# EAGLE design bs_prod (EAGLE 6.5.0)
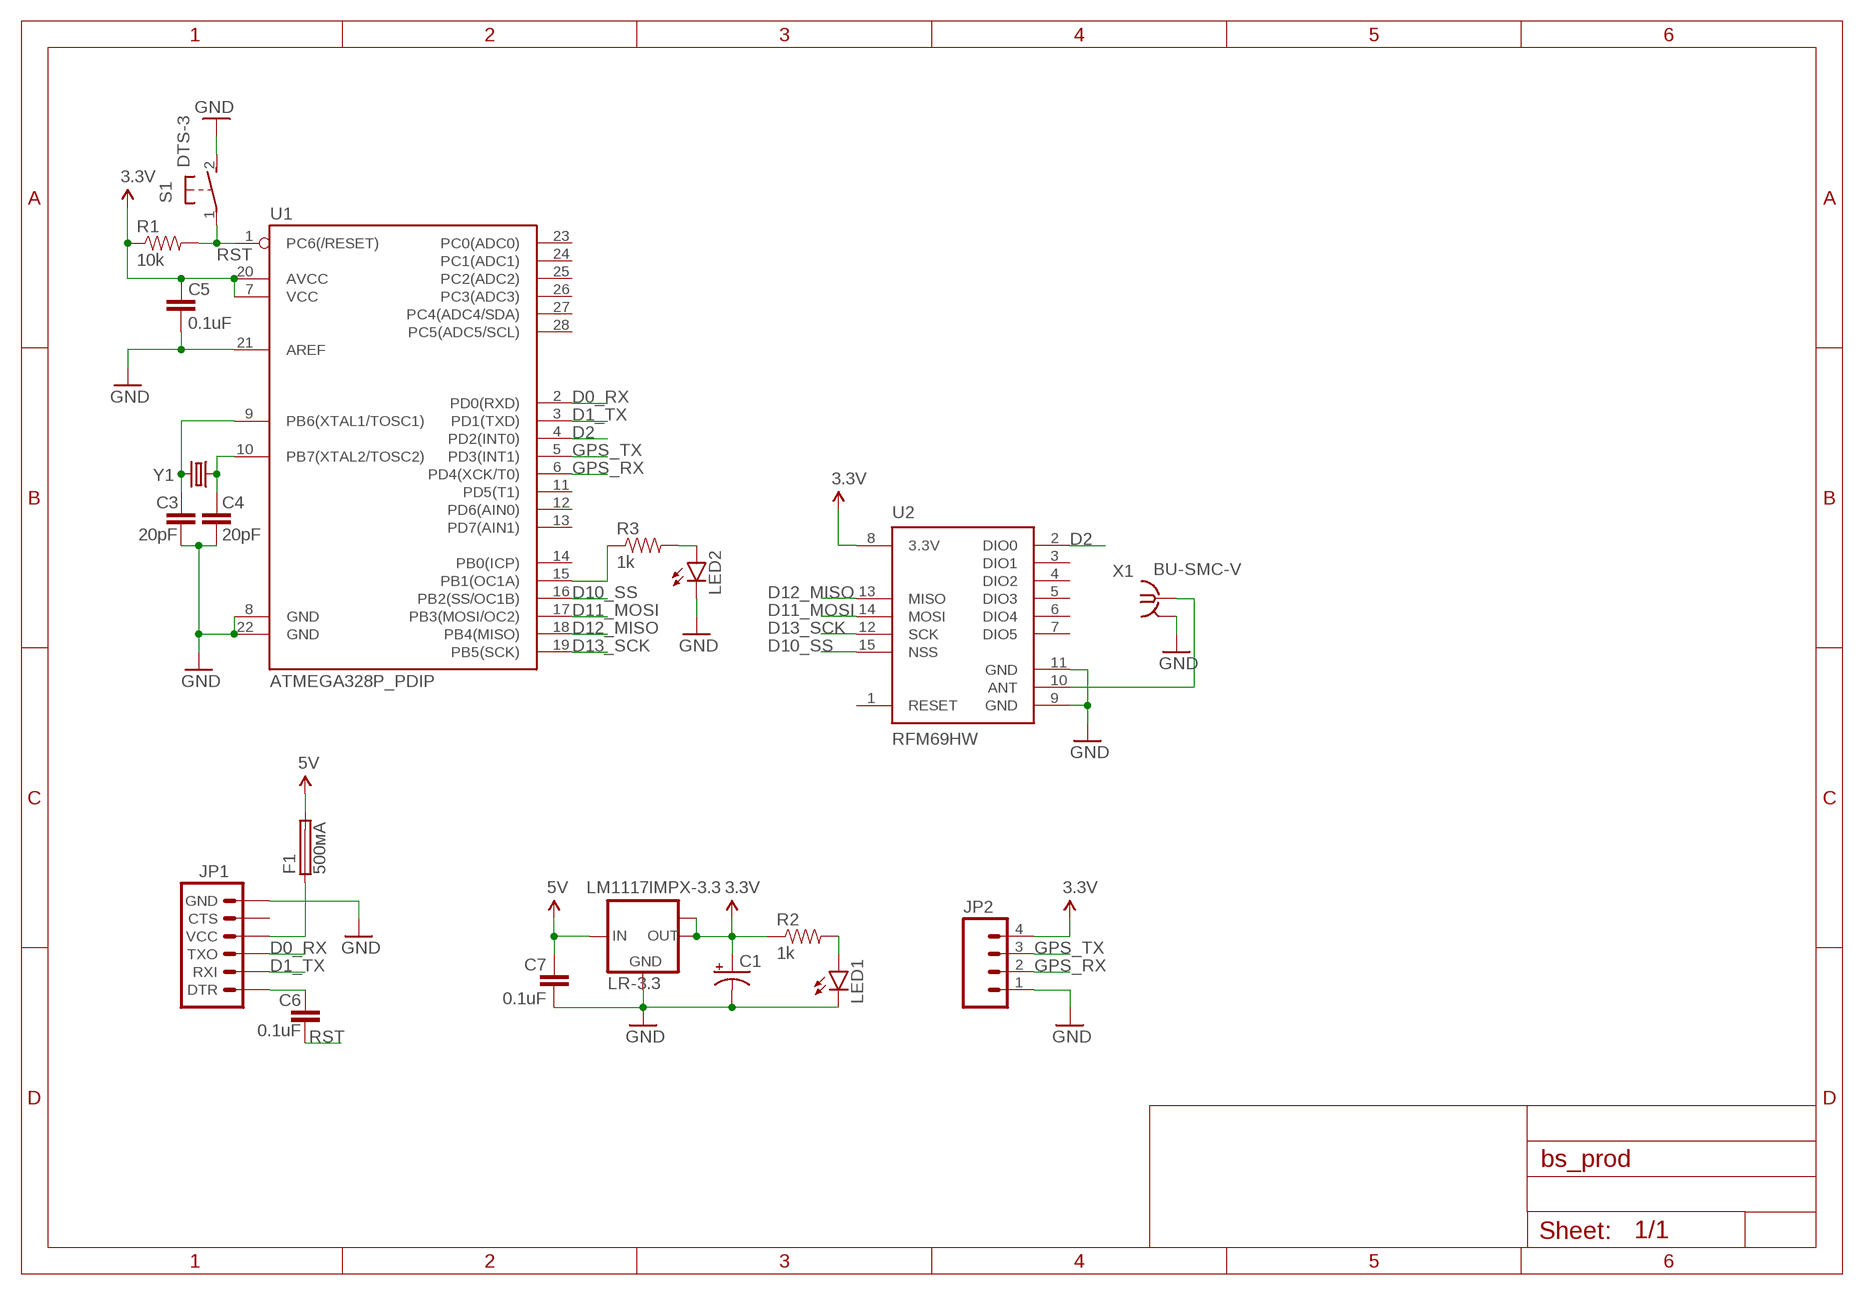
[diagram p0: schematic, sheet 1]

## Parts
C1  47UF-50V-20%(ELECT)  [PANASONIC_D]
C3  20pF  CAP1206  [1206]
C4  20pF  CAP1206  [1206]
C5  0.1uF  CAP1206  [1206]
C6  0.1uF  CAP1206  [1206]
C7  0.1uF  CAP1206  [1206]
F1  500мА  TE5  [TE5]
JP1  ARDUINO_SERIAL_PROGRAMPTH  [1X06]
JP2  M04PTH  [1X04]
LED1  LED1206  [LED-1206]
LED2  LED1206  [LED-1206]
LR-3.3  LM1117IMPX-3.3  [SOT223]
R1  10k  RESISTOR1206  [1206]
R2  1k  RESISTOR1206  [1206]
R3  1k  RESISTOR1206  [1206]
S1  DTS-3  [DTS-3]
U1  ATMEGA328P_PDIP  [DIL28-3]
U2  RFM69HW  [RFM69W-XXXS2]
X1  BU-SMC-V  [BU-SMC-V]
Y1  CRYSTALSMD  [HC49UP]

## Nets
3.3V: C1.+ C5.1 JP2.4 LR-3.3.2(OUT) LR-3.3.TAB(OUT1) R1.1 R2.1 U1.7(VCC) U1.20(AVCC) U2.8(3.3V)
5V: C7.1 F1.2 LR-3.3.3(IN)
D0_RX: JP1.3(TXO) U1.2(PD0(RXD))
D1_TX: JP1.2(RXI) U1.3(PD1(TXD))
D2: U1.4(PD2(INT0)) U2.2(DIO0)
D10_SS: U1.16(PB2(SS/OC1B)) U2.15(NSS)
D11_MOSI: U1.17(PB3(MOSI/OC2)) U2.14(MOSI)
D12_MISO: U1.18(PB4(MISO)) U2.13(MISO)
D13_SCK: U1.19(PB5(SCK)) U2.12(SCK)
GND: C1.- C3.2 C4.2 C5.2 C7.2 JP1.6(GND) JP2.1 LED1.C LED2.C LR-3.3.1(GND) S1.2 U1.8(GND) U1.21(AREF) U1.22(GND) U2.9(GND) U2.11(GND) X1.2 X1.3 X1.4 X1.5
GPS_RX: JP2.2 U1.6(PD4(XCK/T0))
GPS_TX: JP2.3 U1.5(PD3(INT1))
N$5: LED1.A R2.2
N$6: C3.1 U1.9(PB6(XTAL1/TOSC1)) Y1.2
N$7: C4.1 U1.10(PB7(XTAL2/TOSC2)) Y1.1
N$8: U2.10(ANT) X1.1
N$9: F1.1 JP1.4(VCC)
N$11: C6.1 JP1.1(DTR)
N$12: R3.1 U1.15(PB1(OC1A))
N$13: LED2.A R3.2
RST: C6.2 R1.2 S1.1 U1.1(PC6(/RESET))
Unconnected: JP1.5(CTS) U1.11(PD5(T1)) U1.12(PD6(AIN0)) U1.13(PD7(AIN1)) U1.14(PB0(ICP)) U1.23(PC0(ADC0)) U1.24(PC1(ADC1)) U1.25(PC2(ADC2)) U1.26(PC3(ADC3)) U1.27(PC4(ADC4/SDA)) U1.28(PC5(ADC5/SCL)) U2.1(RESET) U2.3(DIO1) U2.4(DIO2) U2.5(DIO3) U2.6(DIO4) U2.7(DIO5)

## Library data of the parts
C1 = SparkFun-Capacitors:47UF-50V-20%(ELECT): CAP-10547; PROD_ID: CAP-10547
C3-C7 = SparkFun-Capacitors:CAP: Capacitor Standard 0603 ceramic capacitor, and 0.1" leaded capacitor.
F1 = fuse:TE5: FUSE Wickmann; OC_FARNELL: unknown; OC_NEWARK: unknown
JP1 = SparkFun-Connectors:ARDUINO_SERIAL_PROGRAM: FTDI connector footprints
JP2 = SparkFun-Connectors:M04: Header 4 Standard 4-pin 0.1" header. Use with straight break away headers (SKU : PRT-00116), right angle break away headers (PRT-00553), swiss pins (PRT-00743), machine pins (PRT-00117), and female headers (PRT-00115). Molex polarized connector foot print use with SKU : PRT-08231 with associated crimp pins and housings. 1MM SMD Version SKU: PRT-10208
LED1 LED2 = SparkFun-LED:LED: LEDs Standard schematic elements and footprints for 5mm, 3mm, 1206, and 0603 sized LEDs. 5mm - Spark Fun Electronics SKU : COM-00529 (and others)
LR-3.3 = lm1117:LM1117IMPX-*
R1-R3 = SparkFun-Resistors:RESISTOR: Resistor Basic schematic elements and footprints for 0603, 1206, and PTH resistors.
S1 = switch-tact:DTS-3
U1 = SparkFun-DigitalIC:ATMEGA328P_PDIP: uC used in the Arduino 32kb flash, 1k EEPROM, 2k SRAM This is the through-hole version of this chip.
U2 = SparkFun-RF:RFM69H
X1 = con-coax:BU-SMC-V: FEMALE SMC CONNECTOR Radiall R112 426 distributor RS 295-5429; OC_FARNELL: unknown; OC_NEWARK: unknown
Y1 = SparkFun-FreqCtrl:CRYSTAL: Various standard crystals. Proven footprints. Spark Fun Electronics SKU : COM-00534

## Board
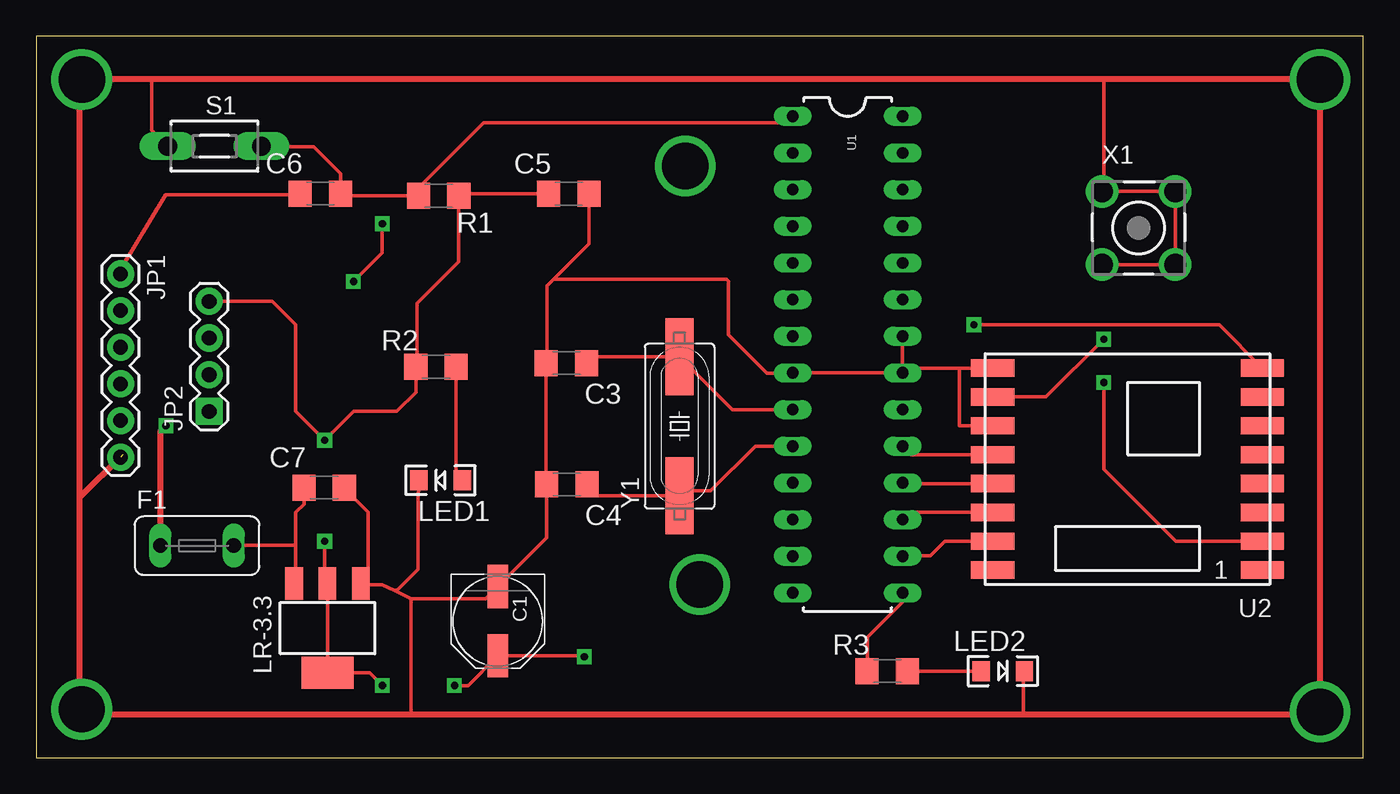
[diagram p1: board, top side]
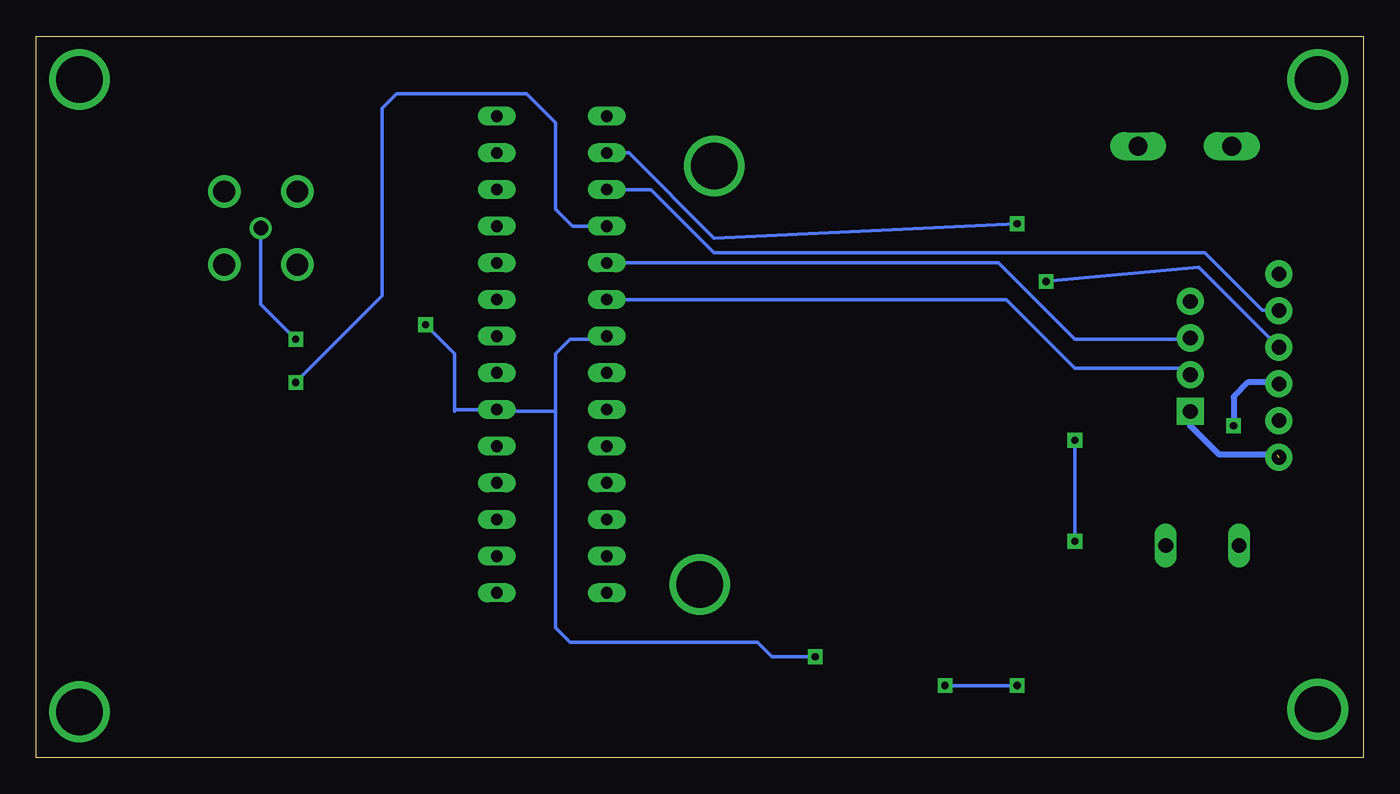
[diagram p2: board, bottom side, seen from below]

Size 92 x 50 mm. Coordinates in mm from the lower left corner, seen from the top.
Outline: 0,0 92,0 92,50 0,50 0,0
Copper layers (1*16): Top 0.035mm / dielectric 1.5mm / Bottom 0.035mm
Design rules "default": minimum track width 10mil, minimum drill 24mil, track to track 8mil, track to pad 8mil, pad to pad 8mil, via to via 8mil, smd to smd 8mil, copper to edge 40mil, drill to drill 8mil, minimum pad ring 10mil, minimum via ring 8mil, stop-mask expansion 4mil, vias tented up to drill 0mil, thermal gap 10mil

### Footprints (pad centres in the part's own frame; a part is rotated, then mirrored left to right if it is on the bottom)
PANASONIC_D = smd 3 x 1.4: + 2.4,0; - -2.4,0
1206 = smd 1.6 x 1.8: 1 -1.4,0; 2 1.4,0
TE5 = drill 1.016 long: 1 -2.54,0; 2 2.54,0
1X06 = drill 1.016 pad 1.88: 1 0,0; 2 2.54,0; 3 5.08,0; 4 7.62,0; 5 10.16,0; 6 12.7,0
1X04 = drill 1.016 pad 1.88 square: 1 0,0 | drill 1.016 pad 1.88: 2 2.54,0; 3 5.08,0; 4 7.62,0
LED-1206 = smd 1.2 x 1.4: A -1.5,0; C 1.5,0
SOT223 = smd 1.219 x 2.235: 1 -2.311,-3.099; 2 0,-3.099; 3 2.311,-3.099 | smd 3.6 x 2.2: TAB 0,3.099
DTS-3 = drill 1.3 long: 1 -3.25,0; 2 3.25,0
DIL28-3 = drill 0.813 long: 1 -16.51,-3.81; 2 -13.97,-3.81; 3 -11.43,-3.81; 4 -8.89,-3.81; 5 -6.35,-3.81; 6 -3.81,-3.81; 7 -1.27,-3.81; 8 1.27,-3.81; 9 3.81,-3.81; 10 6.35,-3.81; 11 8.89,-3.81; 12 11.43,-3.81; 13 13.97,-3.81; 14 16.51,-3.81; 15 16.51,3.81; 16 13.97,3.81; 17 11.43,3.81; 18 8.89,3.81; 19 6.35,3.81; 20 3.81,3.81; 21 1.27,3.81; 22 -1.27,3.81; 23 -3.81,3.81; 24 -6.35,3.81; 25 -8.89,3.81; 26 -11.43,3.81; 27 -13.97,3.81; 28 -16.51,3.81
RFM69W-XXXS2 = smd 3 x 1.2: 1 -9.35,7; 2 -9.35,5; 3 -9.35,3; 4 -9.35,1; 5 -9.35,-1; 6 -9.35,-3; 7 -9.35,-5; 8 -9.35,-7; 9 9.35,-7; 10 9.35,-5; 11 9.35,-3; 12 9.35,-1; 13 9.35,1; 14 9.35,3; 15 9.35,5; 16 9.35,7
BU-SMC-V = drill 1.016: 1 0,0 | drill 1.5: 2 -2.54,2.54; 3 2.54,2.54; 4 2.54,-2.54; 5 -2.54,-2.54
HC49UP = smd 5.334 x 1.93: 1 -4.826,0; 2 4.826,0

### Placement (x,y rotation side)
C1  32,9.46 270 top
C3  36.76,27.35 180 top
C4  36.79,18.94 180 top
C5  36.93,39.08 0 top
C6  19.71,39.09 0 top
C7  19.97,18.72 0 top
F1  11.16,14.7 0 top
JP1  5.86,33.52 270 top
JP2  12,24 90 top
LED1  28.04,19.22 180 top
LED2  67,6 0 top
LR-3.3  20.2,8.98 180 top
R1  27.9,38.94 180 top
R2  27.73,27.08 0 top
R3  59,6 0 top
S1  12.37,42.37 180 top
U1  56.25,27.94 270 top
U2  75.65,20 180 top
X1  76.42,36.7 0 top
Y1  44.6,22.97 90 top

### Tracks (layer width: path | path; a pad name or v marks a point on that pad's centre or on a via)
3.3V  (via drill 0.5 pad 1.02)
  Top 0.254: v29,5 29.94,5 C1.+ 37.94,7.06 v38,7 | v24,5 23.12,5.88 LR-3.3.TAB LR-3.3.2 20,12.28 v20,15 | JP2.4 16.38,31.62 18,30 18,24 v20,22 22,24 25,24 26.32,25.32 R2.1 26.42,27.18 26.42,31.5 29.3,34.38 R1.1 29.43,39.08 C5.1 35.6,39 36,39 | U2.8 82,30 v65,30
  Bottom 0.254: v29,5 v24,5 | v20,15 v20,22 | U1.7 52.65,29 55,29 56,28 56,24 | 56,24 56,9 55,8 42,8 41,7 v38,7 | 56,24 59.94,24 U1.20 62.87,24.13 63,24 63,28 v65,30
5V
  Top 0.254: LR-3.3.3 18,12.19 18,14.73 | 18,14.73 18,17 18.57,17.57 C7.1 | F1.2 13.73,14.73 18,14.73
D0_RX  (via drill 0.5 pad 1.02)
  Top 0.254: v22,33 24,35 v24,37
  Bottom 0.254: JP1.3 11.42,34 v22,33 | v24,37 45,36 50.91,41.91 U1.2
D1_TX
  Bottom 0.254: JP1.2 5.88,31 7,31 11,35 45,35 49.37,39.37 U1.3
D2  (via drill 0.5 pad 1.02)
  Top 0.254: U2.2 79,15 74,20 v74,26
  Bottom 0.254: v74,26 68,32 68,45 67,46 58,46 56,44 56,38 54.83,36.83 U1.4
D10_SS
  Top 0.254: U1.16 60.09,14 62,14 63,15 67,15 U2.15
D11_MOSI
  Top 0.254: U1.17 60.55,17 U2.14
D12_MISO
  Top 0.254: U1.18 60.11,19 U2.13
D13_SCK
  Top 0.254: U1.19 60.65,21 U2.12
GND  (via drill 0.5 pad 1.02)  (1 unrouted)
  Top 0.254: S1.2 8,43.49 8,47 | 24.8,11.6 24,12 22.59,12 LR-3.3.1 23,12.57 23,17 22.28,17.72 C7.2 | 24.8,11.6 26,11 | 26,11 26,3 | 26,11 31.14,11 C1.- 35.39,15.25 C4.2 35.36,18.97 C3.2 35.43,27.42 35.43,32.72 35.86,33.14 | LED1.C 26.47,18.15 26.47,13.06 25.01,11.6 24.8,11.6 | 35.86,33.14 38.33,35.61 C5.2 | 35.86,33.14 47.86,33.14 48,33 48,29.32 50.67,26.64 52.42,26.64 U1.8 U1.21 | U1.21 U1.22 | U1.21 60.39,27 64,27 | 64,27 U2.9 | U2.11 64,23 64,27 | LED2.C 68.43,5.93 68.43,3 | 74,47 74,39.36 X1.2 X1.3 X1.4 X1.5
  Top 0.406: 3,17.96 3,3 26,3 68.43,3 89,3 89,47 74,47 8,47 3,47 3,18 v6,21
  Bottom 0.406: v6,21 10,21 12,23 JP2.1
GPS_RX
  Bottom 0.254: JP2.2 12.46,27 20,27 24.75,31.75 U1.6
GPS_TX
  Bottom 0.254: JP2.3 12.08,29 20,29 25.29,34.29 U1.5
N$1  (via drill 3.2 pad 2.54)
  other vias: 3.16,3.36
N$2  (via drill 3.2 pad 2.54)
  other vias: 88.99,3.17
N$3  (via drill 3.2 pad 2.54)
  other vias: 3.17,46.99
N$5
  Top 0.254: LED1.A 29.12,18.64 R2.2
N$6
  Top 0.254: C3.1 38.61,27.8 Y1.2 48.28,24.13 U1.9
N$7
  Top 0.254: C4.1 38.98,18.15 Y1.1 44.95,18.49 46.76,18.49 49.86,21.59 U1.10
N$8  (via drill 0.5 pad 1.02)
  Top 0.254: U2.10 70,25 v74,29
  Bottom 0.254: v74,29 76.42,31.42 X1.1
N$9  (via drill 0.5 pad 1.02)
  Top 0.406: v9,23 8.62,22.62 F1.1
  Bottom 0.406: JP1.4 5.96,26 8,26 9,25 v9,23
N$10  (via drill 3.2 pad 2.54)
  other vias: 88.99,46.99
N$11
  Top 0.254: C6.1 18.22,39 9,39 5.86,33.86 JP1.1
N$12
  Top 0.254: R3.1 57.63,6.03 57.63,8.36 60.06,10.79 U1.15
N$13
  Top 0.254: LED2.A R3.2
N$14  (via drill 3.2 pad 2.54)
  other vias: 45,41
N$15  (via drill 3.2 pad 1.02)
  other vias: 46,12
RST
  Top 0.254: U1.1 51.99,44 31,44 26.5,39.5 R1.2 21.26,38.95 C6.2 21.11,40.46 19.25,42.32 15.68,42.32 S1.1